# Altium project Autobot_project.PrjPcb
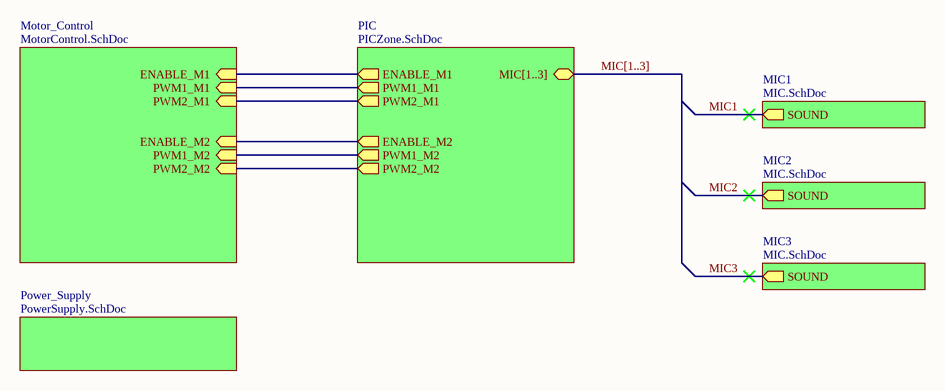
[diagram p0: MicsBus.SchDoc]
5 sheets, 77 parts. Net scope: hierarchical (ports join the sheet entries above them; power ports are global).
Board files: PCBTest.PcbDoc, PCB_Autobot.PcbDoc
Sheets:
  MicsBus.SchDoc
    PIC = PICZone.SchDoc
    Motor_Control = MotorControl.SchDoc
    Power_Supply = PowerSupply.SchDoc
    MIC1 = MIC.SchDoc
    MIC2 = MIC.SchDoc
    MIC3 = MIC.SchDoc

## Sheet MicsBus.SchDoc: Main
size A4; Organization: Autobot Limited; Address1: 96, boulevard Bessiere; Address4: 75017 PARIS; SheetNumber: 1

### Sub-sheets
MIC1 = MIC.SchDoc: SOUND (out)
MIC2 = MIC.SchDoc: SOUND (out)
MIC3 = MIC.SchDoc: SOUND (out)
Motor_Control = MotorControl.SchDoc: PWM1_M1 (in), PWM2_M1 (in), ENABLE_M1 (in), PWM1_M2 (in), PWM2_M2 (in), ENABLE_M2 (in)
PIC = PICZone.SchDoc: MIC[1..3], PWM1_M1 (out), PWM2_M1 (out), ENABLE_M1 (out), ENABLE_M2 (out), PWM1_M2 (out), PWM2_M2 (out)
Power_Supply = PowerSupply.SchDoc: no entries

### Nets
NetL298N_5: sheet PIC/PWM1_M1, sheet Motor_Control/PWM1_M1
NetL298N_6: sheet PIC/ENABLE_M1, sheet Motor_Control/ENABLE_M1
NetL298N_7: sheet PIC/PWM2_M1, sheet Motor_Control/PWM2_M1
NetL298N_10: sheet PIC/PWM1_M2, sheet Motor_Control/PWM1_M2
NetL298N_11: sheet PIC/ENABLE_M2, sheet Motor_Control/ENABLE_M2
NetL298N_12: sheet PIC/PWM2_M2, sheet Motor_Control/PWM2_M2

### Buses and harness runs
bus MIC[1..3] = sheet PIC/MIC[1..3]

### Notes on the sheet
- Title
- Size:
- Date:
- A4
- Number:
- Time:
- Revision:
- Sheet
- of
- File:

## Sheet PICZone.SchDoc: PIC
size A4; Organization: Autobot Limited; Address1: 96, boulevard Bessiere; Address4: 75017 PARIS; SheetNumber: 3
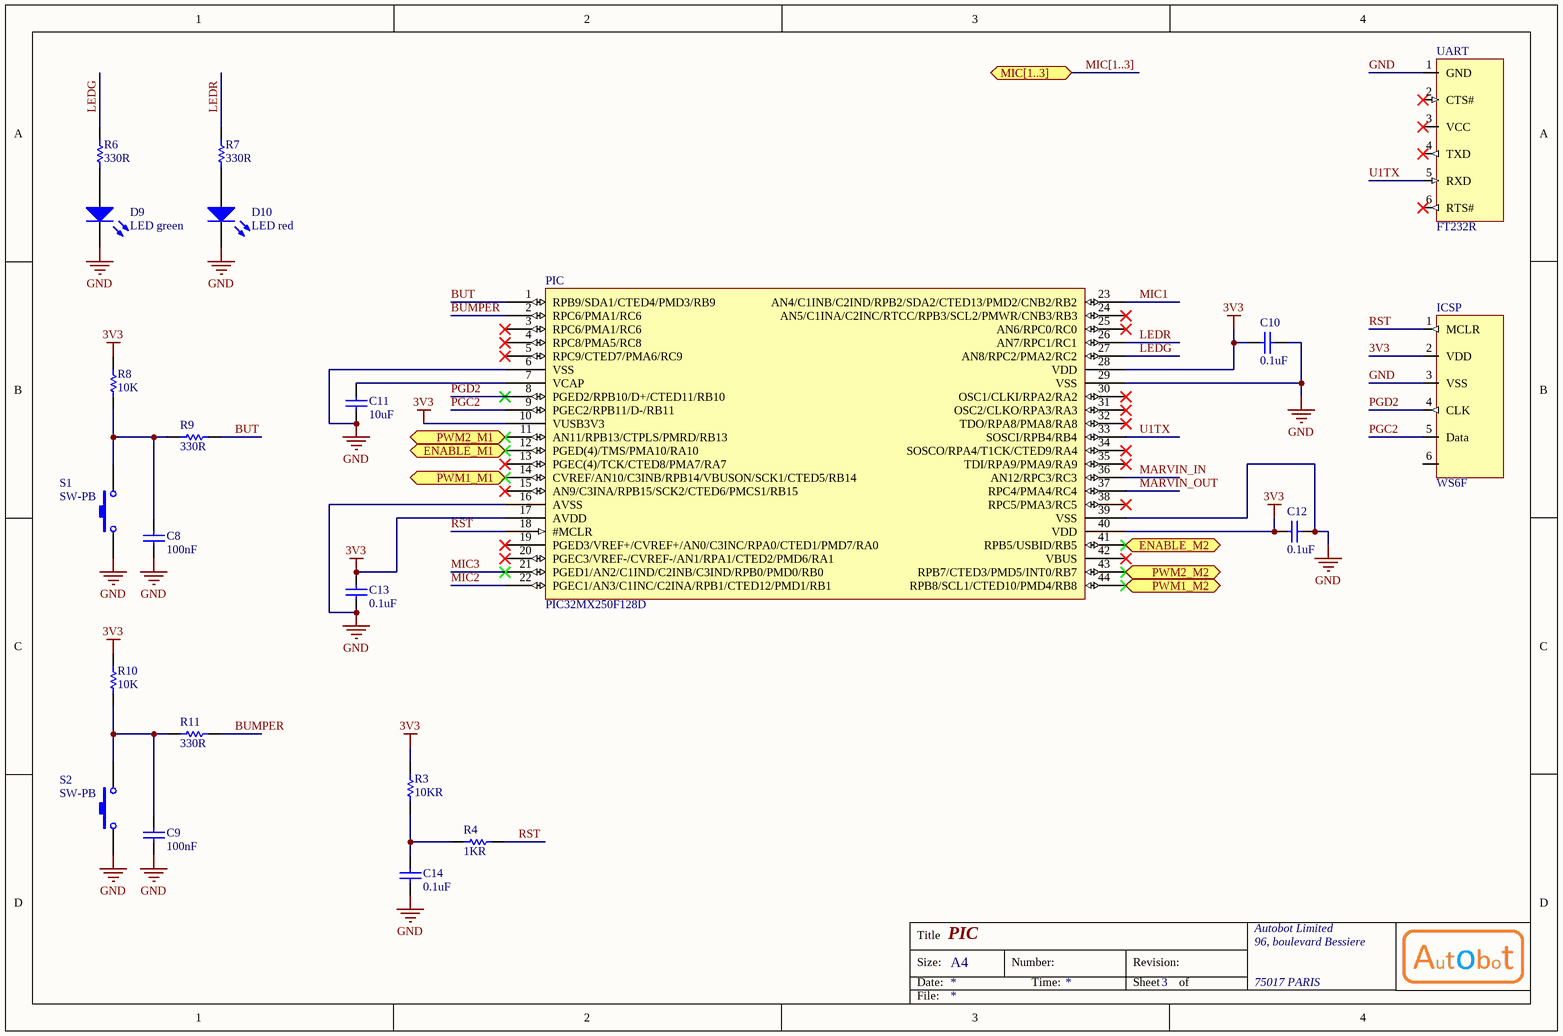
[diagram p1: PICZone.SchDoc]

### Parts
C8  100nF  [CAPC1608N]
C9  100nF  [CAPC1608N]
C10  0.1uF  [CAPC1608N]
C11  10uF  [CAPC1608N]
C12  0.1uF  [CAPC1608N]
C13  0.1uF  [CAPC1608N]
C14  0.1uF  [CAPC1608N]
D9  LED green  [LED1608]
D10  LED red  [LED1608]
ICSP  WS6F  [6-pin Connector]
PIC  PIC32MX250F128D  [44TQFP]
R3  10KR  [RESC1608N]
R4  1KR  [RESC1608N]
R6  330R  [RESC1608N]
R7  330R  [RESC1608N]
R8  10K  [RESC1608N]
R9  330R  [RESC1608N]
R10  10K  [RESC1608N]
R11  330R  [RESC1608N]
S1  SW-PB  [SPST-2]
S2  SW-PB  [SPST-2]
UART  FT232R  [6-pin Connector]

### Ports
ENABLE_M1 (out), ENABLE_M2 (out), MIC[1..3], PWM1_M1 (out), PWM1_M2 (out), PWM2_M1 (out), PWM2_M2 (out)

### Nets
3V3: C10.2 C12.2 C13.1 ICSP.2(VDD) PIC.10(VUSB3V3) PIC.17(AVDD) PIC.28(VDD) PIC.40(VDD) R3.1 R8.2 R10.2
GND: C8.2 C9.2 C10.1 C11.2 C12.1 C13.2 C14.1 D9.2(K) D10.2(K) ICSP.3(VSS) PIC.6(VSS) PIC.16(AVSS) PIC.29(VSS) PIC.39(VSS) S1.1 S2.1 UART.1(GND)
BUMPER: PIC.2(RPC6/PMA1/RC6) R11.1
BUT: PIC.1(RPB9/SDA1/CTED4/PMD3/RB9) R9.1
LEDG: PIC.27(AN8/RPC2/PMA2/RC2) R6.2
LEDR: PIC.26(AN7/RPC1/RC1) R7.2
MARVIN_IN: PIC.36(AN12/RPC3/RC3)
MARVIN_OUT: PIC.37(RPC4/PMA4/RC4)
MIC1: PIC.23(AN4/C1INB/C2IND/RPB2/SDA2/CTED13/PMD2/CNB2/RB2)
MIC2: PIC.22(PGEC1/AN3/C1INC/C2INA/RPB1/CTED12/PMD1/RB1)
MIC3: PIC.21(PGED1/AN2/C1IND/C2INB/C3IND/RPB0/PMD0/RB0)
PGC2: ICSP.5(Data) PIC.9(PGEC2/RPB11/D-/RB11)
PGD2: ICSP.4(CLK) PIC.8(PGED2/RPB10/D+/CTED11/RB10)
RST: ICSP.1(MCLR) PIC.18(#MCLR) R4.1
U1TX: PIC.33(SOSCI/RPB4/RB4) UART.5(RXD)
NetC8_1: C8.1 R8.1 R9.2 S1.2
NetC9_1: C9.1 R10.1 R11.2 S2.2
NetC11_1: C11.1 PIC.7(VCAP)
NetC14_2: C14.2 R3.2 R4.2
NetD9_1: D9.1(A) R6.1
NetD10_1: D10.1(A) R7.1
NetL298N_5: PIC.14(CVREF/AN10/C3INB/RPB14/VBUSON/SCK1/CTED5/RB14) ; port PWM1_M1
NetL298N_6: PIC.12(PGED(4)/TMS/PMA10/RA10) ; port ENABLE_M1
NetL298N_7: PIC.11(AN11/RPB13/CTPLS/PMRD/RB13) ; port PWM2_M1
NetL298N_10: PIC.44(RPB8/SCL1/CTED10/PMD4/RB8) ; port PWM1_M2
NetL298N_11: PIC.41(RPB5/USBID/RB5) ; port ENABLE_M2
NetL298N_12: PIC.43(RPB7/CTED3/PMD5/INT0/RB7) ; port PWM2_M2

Not connected (* = marked no-connect by the designer): ICSP 6; PIC 3(RPC6/PMA1/RC6)* 4(RPC8/PMA5/RC8)* 5(RPC9/CTED7/PMA6/RC9)* 13(PGEC(4)/TCK/CTED8/PMA7/RA7)* 15(AN9/C3INA/RPB15/SCK2/CTED6/PMCS1/RB15)* 19(PGED3/VREF+/CVREF+/AN0/C3INC/RPA0/CTED1/PMD7/RA0)* 20(PGEC3/VREF-/CVREF-/AN1/RPA1/CTED2/PMD6/RA1)* 24(AN5/C1INA/C2INC/RTCC/RPB3/SCL2/PMWR/CNB3/RB3)* 25(AN6/RPC0/RC0)* 30(OSC1/CLKI/RPA2/RA2)* 31(OSC2/CLKO/RPA3/RA3)* 32(TDO/RPA8/PMA8/RA8)* 34(SOSCO/RPA4/T1CK/CTED9/RA4)* 35(TDI/RPA9/PMA9/RA9)* 38(RPC5/PMA3/RC5)* 42(VBUS)*; UART 2(CTS#)* 3(VCC)* 4(TXD)* 6(RTS#)*

### Buses and harness runs
bus MIC[1..3] = port MIC[1..3]

### Notes on the sheet
- Title
- Size:
- Date:
- A4
- Number:
- Time:
- Revision:
- Sheet
- of
- File:

### Library data of the parts
C8-C14 = Cap: Capacitor; Published: 8-Jun-2000; LatestRevisionDate: 17-Jul-2002; LatestRevisionNote: Re-released for DXP Platform.; PackageReference: RAD-0.3; Publisher: Altium Limited; PackageDescription: Radial Cap, Thru-Hole; 2 Leads; 0.3 in Pin Spacing
  C8 C9: Value: 100nF
  C10 C12-C14: Value: 0.1uF
  C11: Value: 10uF
D9 D10 = LED0: Typical INFRARED GaAs LED; Fabricant: DIODES INC.; Fournisseur: Farnell; RefFabricant: MURS140-13-F; RefFournisseur: 1858656; Published: 8-Jun-2000; LatestRevisionDate: 08-Jul-2005; LatestRevisionNote: Mech Layer 1 removed.; PackageReference: LED-0; Publisher: Altium Limited; PackageDescription: LED; 2 Leads
ICSP = WS6F: Fabricant: MOLEX; Fournisseur: Farnell; RefFournisseur: 1462951; RefFabricant: 22-11-2062
PIC = PIC32MX250F128D: Fabricant: MICROCHIP; Fournisseur: Farnell; RefFabricant: PIC32MX250F128D-50I-PT; RefFournisseur: 2357347
R3 R4 R6-R11 = Res1: Resistor; Published: 8-Jun-2000; LatestRevisionDate: 17-Jul-2002; LatestRevisionNote: Re-released for DXP Platform.; PackageReference: AXIAL-0.3; Publisher: Altium Limited; PackageDescription: Axial Device, Thru-Hole; 2 Leads; 0.3 in Pin Spacing
  R3: Value: 10KR
  R4: Value: 1KR
  R6 R7 R9 R11: Value: 330R
  R8 R10: Value: 10K
S1 = SW-PB: Switch; Fabricant: MULTICOMP; Fournisseur: Farnell; RefFabricant: R13-509B-05-BB; RefFournisseur: 1634683; Published: 24-Mar-1999; LatestRevisionDate: 17-Jul-2002; LatestRevisionNote: Re-released for DXP Platform.; PackageReference: SPST-2; Publisher: Altium Limited; PackageDescription: Switch; 2 Leads
S2 = SW-PB: Switch; Fabricant: MULTICOMP; Fournisseur: Farnell; RefFabricant: R13-509B-05-BR; RefFournisseur: 1634685; Published: 24-Mar-1999; LatestRevisionDate: 17-Jul-2002; LatestRevisionNote: Re-released for DXP Platform.; PackageReference: SPST-2; Publisher: Altium Limited; PackageDescription: Switch; 2 Leads
UART = FT232R: Fabricant: MOLEX; Fournisseur: Farnell; RefFournisseur: 9731164; RefFabricant: 22-27-2041

## Sheet MotorControl.SchDoc: Motor Control
size A4; Organization: Autobot Limited; Address1: 96, boulevard Bessiere; Address4: 75017 PARIS; SheetNumber: 2
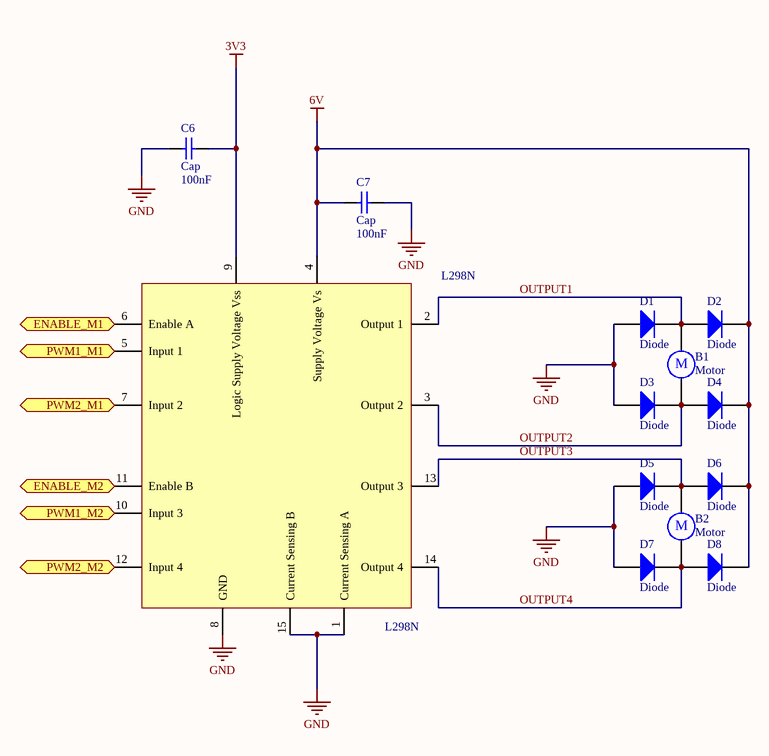
[diagram p2: MotorControl.SchDoc]

### Parts
B1  Motor  [BORNIER]
B2  Motor  [BORNIER]
C6  Cap  value 100nF  [CAPC1608N]
C7  Cap  value 100nF  [CAPC1608N]
D1  Diode  [DIODE]
D2  Diode  [DIODE]
D3  Diode  [DIODE]
D4  Diode  [DIODE]
D5  Diode  [DIODE]
D6  Diode  [DIODE]
D7  Diode  [DIODE]
D8  Diode  [DIODE]
L298N  L298N  [L298N]

### Ports
ENABLE_M1 (in), ENABLE_M2 (in), PWM1_M1 (in), PWM1_M2 (in), PWM2_M1 (in), PWM2_M2 (in)

### Nets
3V3: C6.1 L298N.9(Logic_Supply_Voltage_Vss)
6V: C7.1 D2.2(K) D4.2(K) D6.2(K) D8.2(K) L298N.4(Supply_Voltage_Vs)
GND: C6.2 C7.2 D1.1(A) D3.1(A) D5.1(A) D7.1(A) L298N.1(Current_Sensing_A) L298N.8(GND) L298N.15(Current_Sensing_B)
OUTPUT1: B1.1 D1.2(K) D2.1(A) L298N.2(Output_1)
OUTPUT2: B1.2 D3.2(K) D4.1(A) L298N.3(Output_2)
OUTPUT3: B2.1 D5.2(K) D6.1(A) L298N.13(Output_3)
OUTPUT4: B2.2 D7.2(K) D8.1(A) L298N.14(Output_4)
NetL298N_5: L298N.5(Input_1) ; port PWM1_M1
NetL298N_6: L298N.6(Enable_A) ; port ENABLE_M1
NetL298N_7: L298N.7(Input_2) ; port PWM2_M1
NetL298N_10: L298N.10(Input_3) ; port PWM1_M2
NetL298N_11: L298N.11(Enable_B) ; port ENABLE_M2
NetL298N_12: L298N.12(Input_4) ; port PWM2_M2

### Notes on the sheet
- Title
- Size:
- Date:
- A4
- Number:
- Time:
- Revision:
- Sheet
- of
- File:
- (in symbol Motor) M

### Library data of the parts
B1 B2 = Motor: Motor, General Kind; Fournisseur: Olimex; Published: 24-Mar-1999; LatestRevisionDate: 17-Jul-2002; LatestRevisionNote: Re-released for DXP Platform.; PackageReference: RB5-10.5; Publisher: Altium Limited; PackageDescription: Capacitor (Radial); 2 Leads
C6 C7 = Cap: Capacitor; Published: 8-Jun-2000; LatestRevisionDate: 17-Jul-2002; LatestRevisionNote: Re-released for DXP Platform.; PackageReference: RAD-0.3; Publisher: Altium Limited; PackageDescription: Radial Cap, Thru-Hole; 2 Leads; 0.3 in Pin Spacing
D1-D8 = Diode: Default Diode; Fabricant: DIODES INC.; Fournisseur: Farnell; RefFabricant: MURS140-13-F; RefFournisseur: 1858656; Published: 8-Jun-2000; LatestRevisionDate: 17-Jul-2002; LatestRevisionNote: Re-released for DXP Platform.; PackageVersion: Sep-1996; PackageReference: SMC; Publisher: Altium Limited; PackageDescription: DO-214-AB/SMC; 2 C-Bend Leads; Body 7.9 x 5.9 mm, inc. leads (LxW); Code_JEDEC: DO-214-AB
L298N = L298N: Fabricant: STMICROELECTRONICS; Fournisseur: Farnell; RefFournisseur: 403295; RefFabricant: L298N

## Sheet PowerSupply.SchDoc
size A4; Organization: Autobot Limited; Address1: 96, boulevard Bessiere; Address4: 75017 PARIS
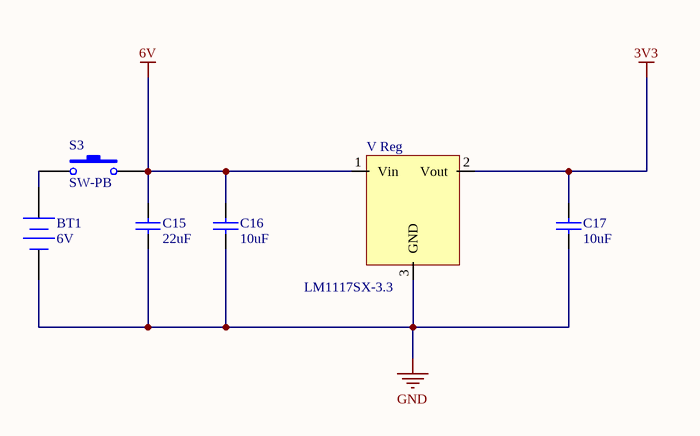
[diagram p3: PowerSupply.SchDoc]

### Parts
BT1  6V  [BAT-2]
C15  22uF  [CAPC1608N]
C16  10uF  [CAPC1608N]
C17  10uF  [CAPC1608N]
S3  SW-PB  [SPST-2]
V_Reg  LM1117SX-3.3  [TO-263-3]

### Nets
3V3: C17.2 V_Reg.2(Vout)
6V: C15.2 C16.2 S3.2 V_Reg.1(Vin)
GND: BT1.2(-) C15.1 C16.1 C17.1 V_Reg.3(GND)
NetBT1_1: BT1.1(+) S3.1

### Notes on the sheet
- Title
- Size:
- Date:
- A4
- Number:
- Time:
- Revision:
- Sheet
- of
- File:

### Library data of the parts
BT1 = Battery: Multicell Battery; Fournisseur: Olimex; Published: 24-Mar-1999; LatestRevisionDate: 17-Jul-2002; LatestRevisionNote: Re-released for DXP Platform.; PackageReference: BAT-2; Publisher: Altium Limited; PackageDescription: Battery; 2 Leads; Value: 6V
C15-C17 = Cap: Capacitor; Published: 8-Jun-2000; LatestRevisionDate: 17-Jul-2002; LatestRevisionNote: Re-released for DXP Platform.; PackageReference: RAD-0.3; Publisher: Altium Limited; PackageDescription: Radial Cap, Thru-Hole; 2 Leads; 0.3 in Pin Spacing
  C15: Value: 22uF
  C16 C17: Value: 10uF
S3 = SW-PB: Switch; Fabricant: MULTICOMP; Fournisseur: Farnell; RefFabricant: R13-608C1-02-BB-9A; RefFournisseur: 1634617; Published: 24-Mar-1999; LatestRevisionDate: 17-Jul-2002; LatestRevisionNote: Re-released for DXP Platform.; PackageReference: SPST-2; Publisher: Altium Limited; PackageDescription: Switch; 2 Leads
V_Reg = LM1117SX-3.3: Fabricant: TEXAS INSTRUMENT; Fournisseur: Farnell; RefFabricant: LM1117SX-3.3/NOPB; RefFournisseur: 2323594

## Sheet MIC.SchDoc: Mic
size A4; Organization: Autobot Limited; Address1: 96, boulevard Bessiere; Address4: 75017 PARIS; SheetNumber: 4
Used 3 times, as channels MIC1, MIC2, MIC3. Parts and nets are listed once, with the designators drawn on the sheet.
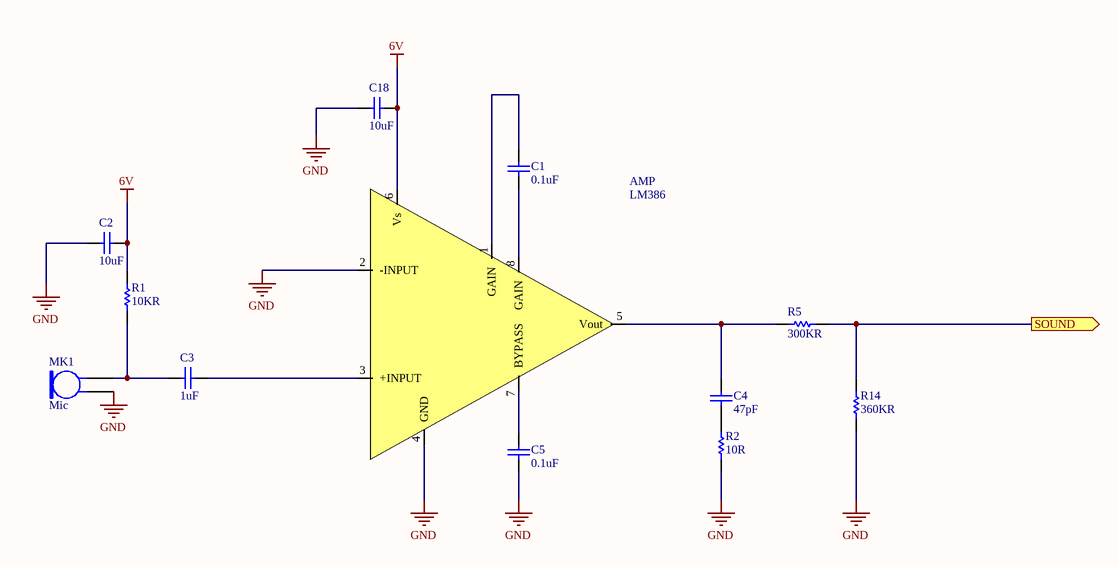
[diagram p4: MIC.SchDoc]

### Parts
AMP  LM386  [Ampli]
C1  0.1uF  [CAPC1608N]
C2  10uF  [CAPC1608N]
C3  1uF  [CAPC1608N]
C4  47pF  [CAPC1608N]
C5  0.1uF  [CAPC1608N]
C18  10uF  [CAPC1608N]
MK1  Mic  [BORNIER]
R1  10KR  [RESC1608N]
R2  10R  [RESC1608N]
R5  300KR  [RESC1608N]
R14  360KR  [RESC1608N]

### Ports
SOUND (out)

### Nets
6V: AMP.6(Vs) C2.2 C18.2 R1.1
GND: AMP.2(-INPUT) AMP.4(GND) C2.1 C5.2 C18.1 MK1.1 R2.2 R14.2
SOUND: R5.2 R14.1 ; port SOUND
NetAMP_1: AMP.1(GAIN) C1.1
NetAMP_3: AMP.3(+INPUT) C3.1
NetAMP_5: AMP.5(Vout) C4.1 R5.1
NetAMP_7: AMP.7(BYPASS) C5.1
NetAMP_8: AMP.8(GAIN) C1.2
NetC3_2: C3.2 MK1.2 R1.2
NetC4_2: C4.2 R2.1

### Channels
MIC1: designators end in _MIC1; ports SOUND=MIC1
MIC2: designators end in _MIC2; ports SOUND=MIC2
MIC3: designators end in _MIC3; ports SOUND=MIC3

### Notes on the sheet
- Title
- Size:
- Date:
- A4
- Number:
- Time:
- Revision:
- Sheet
- of
- File:

### Library data of the parts
AMP = LM386: RefFabricant: LM386N-1/NOPB; Fabricant: TEXAS INSTRUMENT; Fournisseur: Farnell; RefFournisseur: 2496437
C1-C5 C18 = Cap: Capacitor; Published: 8-Jun-2000; LatestRevisionDate: 17-Jul-2002; LatestRevisionNote: Re-released for DXP Platform.; PackageReference: RAD-0.3; Publisher: Altium Limited; PackageDescription: Radial Cap, Thru-Hole; 2 Leads; 0.3 in Pin Spacing
  C1 C5: Value: 0.1uF
  C2 C18: Value: 10uF
  C3: Value: 1uF
  C4: Value: 47pF
MK1 = Mic2: Microphone; Fabricant: PRO SIGNAL; Fournisseur: Farnell; RefFabricant: ABM-708-RC; RefFournisseur: 1736564; Published: 24-Mar-1999; LatestRevisionDate: 17-Jul-2002; LatestRevisionNote: Re-released for DXP Platform.; PackageReference: PIN2; Publisher: Altium Limited
R1 R2 R5 R14 = Res1: Resistor; Published: 8-Jun-2000; LatestRevisionDate: 17-Jul-2002; LatestRevisionNote: Re-released for DXP Platform.; PackageReference: AXIAL-0.3; Publisher: Altium Limited; PackageDescription: Axial Device, Thru-Hole; 2 Leads; 0.3 in Pin Spacing
  R1: Value: 10KR
  R2: Value: 10R
  R5: Value: 300KR
  R14: Value: 360KR

## Nets that join several sheets
3V3: PICZone (11 pins), MotorControl (C6.1 L298N.9), PowerSupply (C17.2 V_Reg.2)
6V: MotorControl (6 pins), PowerSupply (C15.2 C16.2 S3.2 V_Reg.1), MIC1 (AMP_MIC1.6 C2_MIC1.2 C18_MIC1.2 R1_MIC1.1), MIC2 (AMP_MIC2.6 C2_MIC2.2 C18_MIC2.2 R1_MIC2.1), MIC3 (AMP_MIC3.6 C2_MIC3.2 C18_MIC3.2 R1_MIC3.1)
GND: PICZone (17 pins), MotorControl (9 pins), PowerSupply (5 pins), MIC1 (8 pins), MIC2 (8 pins), MIC3 (8 pins)
MIC1: PICZone (PIC.23), MIC1 (R5_MIC1.2 R14_MIC1.1)
MIC2: PICZone (PIC.22), MIC2 (R5_MIC2.2 R14_MIC2.1)
MIC3: PICZone (PIC.21), MIC3 (R5_MIC3.2 R14_MIC3.1)
NetL298N_5: PICZone (PIC.14), MotorControl (L298N.5)
NetL298N_6: PICZone (PIC.12), MotorControl (L298N.6)
NetL298N_7: PICZone (PIC.11), MotorControl (L298N.7)
NetL298N_10: PICZone (PIC.44), MotorControl (L298N.10)
NetL298N_11: PICZone (PIC.41), MotorControl (L298N.11)
NetL298N_12: PICZone (PIC.43), MotorControl (L298N.12)